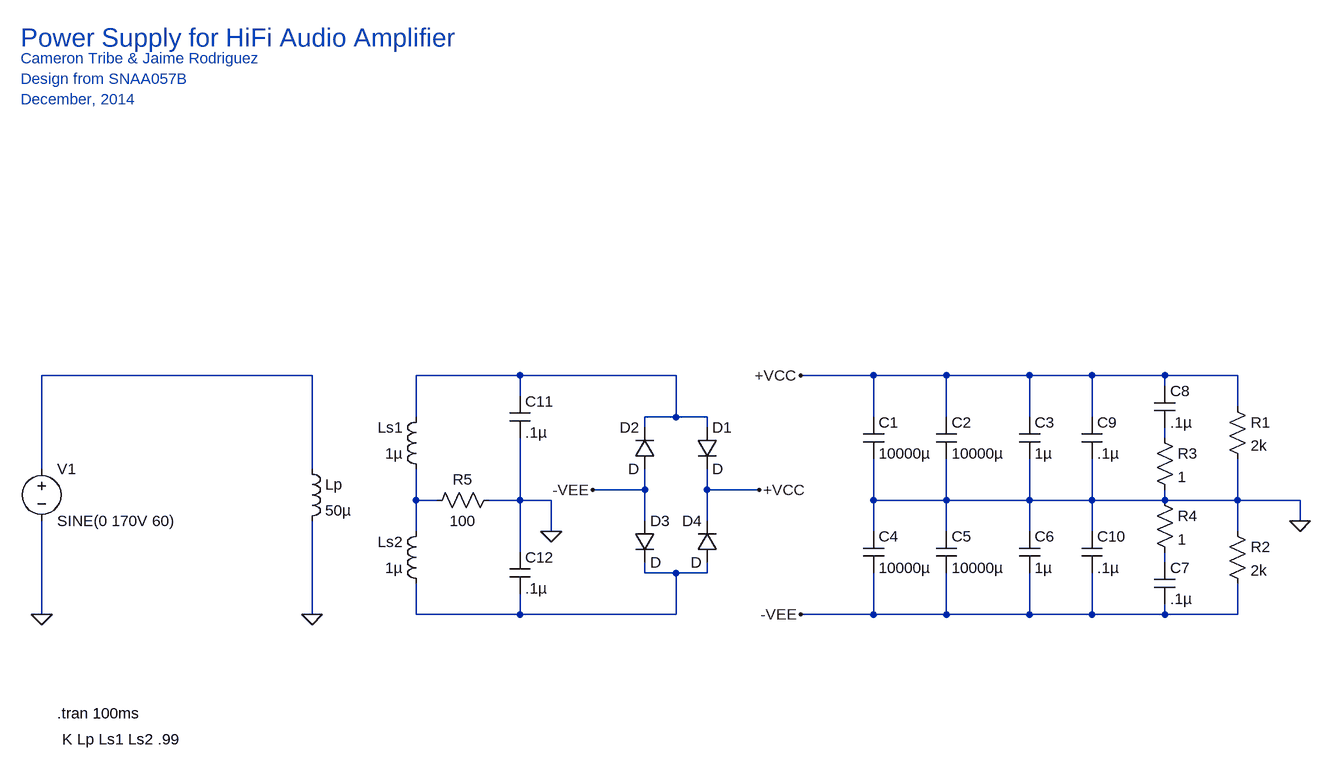
[diagram p0: schematic Power Supply.asc]
Power Supply.asc, the LTspice schematic file:
Version 4
SHEET 1 2032 752
WIRE 496 176 80 176
WIRE 816 176 656 176
WIRE 1056 176 816 176
WIRE 1360 176 1248 176
WIRE 1472 176 1360 176
WIRE 1600 176 1472 176
WIRE 1696 176 1600 176
WIRE 1808 176 1696 176
WIRE 1920 176 1808 176
WIRE 1808 192 1808 176
WIRE 816 208 816 176
WIRE 1920 224 1920 176
WIRE 656 240 656 176
WIRE 1056 240 1056 176
WIRE 1056 240 1008 240
WIRE 1104 240 1056 240
WIRE 1360 240 1360 176
WIRE 1472 240 1472 176
WIRE 1600 240 1600 176
WIRE 1696 240 1696 176
WIRE 1008 256 1008 240
WIRE 1104 256 1104 240
WIRE 1808 272 1808 256
WIRE 80 320 80 176
WIRE 496 320 496 176
WIRE 1008 352 1008 320
WIRE 1008 352 928 352
WIRE 1104 352 1104 320
WIRE 1184 352 1104 352
WIRE 656 368 656 320
WIRE 688 368 656 368
WIRE 816 368 816 272
WIRE 816 368 768 368
WIRE 864 368 816 368
WIRE 1360 368 1360 304
WIRE 1472 368 1472 304
WIRE 1472 368 1360 368
WIRE 1600 368 1600 304
WIRE 1600 368 1472 368
WIRE 1696 368 1696 304
WIRE 1696 368 1600 368
WIRE 1808 368 1808 352
WIRE 1808 368 1696 368
WIRE 1920 368 1920 304
WIRE 1920 368 1808 368
WIRE 2016 368 1920 368
WIRE 1008 400 1008 352
WIRE 1104 400 1104 352
WIRE 2016 400 2016 368
WIRE 656 416 656 368
WIRE 864 416 864 368
WIRE 1360 416 1360 368
WIRE 1472 416 1472 368
WIRE 1600 416 1600 368
WIRE 1696 416 1696 368
WIRE 1920 416 1920 368
WIRE 816 448 816 368
WIRE 1808 464 1808 448
WIRE 1008 480 1008 464
WIRE 1056 480 1008 480
WIRE 1104 480 1104 464
WIRE 1104 480 1056 480
WIRE 80 544 80 400
WIRE 496 544 496 400
WIRE 656 544 656 496
WIRE 816 544 816 512
WIRE 816 544 656 544
WIRE 1056 544 1056 480
WIRE 1056 544 816 544
WIRE 1360 544 1360 480
WIRE 1360 544 1248 544
WIRE 1472 544 1472 480
WIRE 1472 544 1360 544
WIRE 1600 544 1600 480
WIRE 1600 544 1472 544
WIRE 1696 544 1696 480
WIRE 1696 544 1600 544
WIRE 1808 544 1808 528
WIRE 1808 544 1696 544
WIRE 1920 544 1920 496
WIRE 1920 544 1808 544
FLAG 1184 352 +VCC
FLAG 928 352 -VEE
FLAG 1248 176 +VCC
FLAG 1248 544 -VEE
FLAG 80 544 0
FLAG 496 544 0
FLAG 2016 400 0
FLAG 864 416 0
SYMBOL voltage 80 304 R0
SYMATTR InstName V1
SYMATTR Value SINE(0 170V 60)
SYMATTR SpiceLine Rser=.00001
SYMBOL diode 1088 256 R0
SYMATTR InstName D1
SYMBOL diode 1024 320 R180
WINDOW 0 24 64 Left 2
WINDOW 3 24 0 Left 2
SYMATTR InstName D2
SYMBOL diode 992 400 R0
SYMATTR InstName D3
SYMBOL diode 1120 464 R180
WINDOW 0 24 64 Left 2
WINDOW 3 24 0 Left 2
SYMATTR InstName D4
SYMBOL ind 480 304 R0
SYMATTR InstName Lp
SYMATTR Value 50µ
SYMBOL ind 672 336 R180
WINDOW 0 36 80 Left 2
WINDOW 3 36 40 Left 2
SYMATTR InstName Ls1
SYMATTR Value 1µ
SYMBOL ind 672 512 R180
WINDOW 0 36 80 Left 2
WINDOW 3 36 40 Left 2
SYMATTR InstName Ls2
SYMATTR Value 1µ
SYMBOL cap 1344 240 R0
SYMATTR InstName C1
SYMATTR Value 10000µ
SYMBOL cap 1456 240 R0
SYMATTR InstName C2
SYMATTR Value 10000µ
SYMBOL cap 1584 240 R0
SYMATTR InstName C3
SYMATTR Value 1µ
SYMBOL cap 1344 416 R0
SYMATTR InstName C4
SYMATTR Value 10000µ
SYMBOL cap 1456 416 R0
SYMATTR InstName C5
SYMATTR Value 10000µ
SYMBOL cap 1584 416 R0
SYMATTR InstName C6
SYMATTR Value 1µ
SYMBOL cap 1792 464 R0
SYMATTR InstName C7
SYMATTR Value .1µ
SYMBOL cap 1792 192 R0
SYMATTR InstName C8
SYMATTR Value .1µ
SYMBOL res 1904 208 R0
SYMATTR InstName R1
SYMATTR Value 2k
SYMBOL res 1904 400 R0
SYMATTR InstName R2
SYMATTR Value 2k
SYMBOL res 1792 256 R0
SYMATTR InstName R3
SYMATTR Value 1
SYMBOL res 1792 352 R0
SYMATTR InstName R4
SYMATTR Value 1
SYMBOL cap 1680 240 R0
SYMATTR InstName C9
SYMATTR Value .1µ
SYMBOL cap 1680 416 R0
SYMATTR InstName C10
SYMATTR Value .1µ
SYMBOL res 784 352 R90
WINDOW 0 0 56 VBottom 2
WINDOW 3 32 56 VTop 2
SYMATTR InstName R5
SYMATTR Value 100
SYMBOL cap 800 208 R0
SYMATTR InstName C11
SYMATTR Value .1µ
SYMBOL cap 800 448 R0
SYMATTR InstName C12
SYMATTR Value .1µ
TEXT 112 736 Left 2 !K Lp Ls1 Ls2 .99
TEXT 104 696 Left 2 !.tran 100ms
TEXT 48 -344 Left 4 ;Power Supply for HiFi Audio Amplifier
TEXT 48 -312 Left 2 ;Cameron Tribe & Jaime Rodriguez\nDesign from SNAA057B\nDecember, 2014

The netlist it stands for:
* Power Supply.asc
V1 N001 0 SINE(0 170V 60) Rser=.00001
D1 N002 +VCC D
D2 -VEE N002 D
D3 -VEE N006 D
D4 N006 +VCC D
Lp N001 0 50µ
Ls1 N004 N002 1µ
Ls2 N006 N004 1µ
C1 +VCC 0 10000µ
C2 +VCC 0 10000µ
C3 +VCC 0 1µ
C4 0 -VEE 10000µ
C5 0 -VEE 10000µ
C6 0 -VEE 1µ
C7 N005 -VEE .1µ
C8 +VCC N003 .1µ
R1 +VCC 0 2k
R2 0 -VEE 2k
R3 N003 0 1
R4 0 N005 1
C9 +VCC 0 .1µ
C10 0 -VEE .1µ
R5 0 N004 100
C11 N002 0 .1µ
C12 0 N006 .1µ
.model D D
.lib standard.dio
K Lp Ls1 Ls2 .99
.tran 100ms
* Power Supply for HiFi Audio Amplifier
* Cameron Tribe & Jaime Rodriguez
* Design from SNAA057B
* December, 2014
.backanno
.end